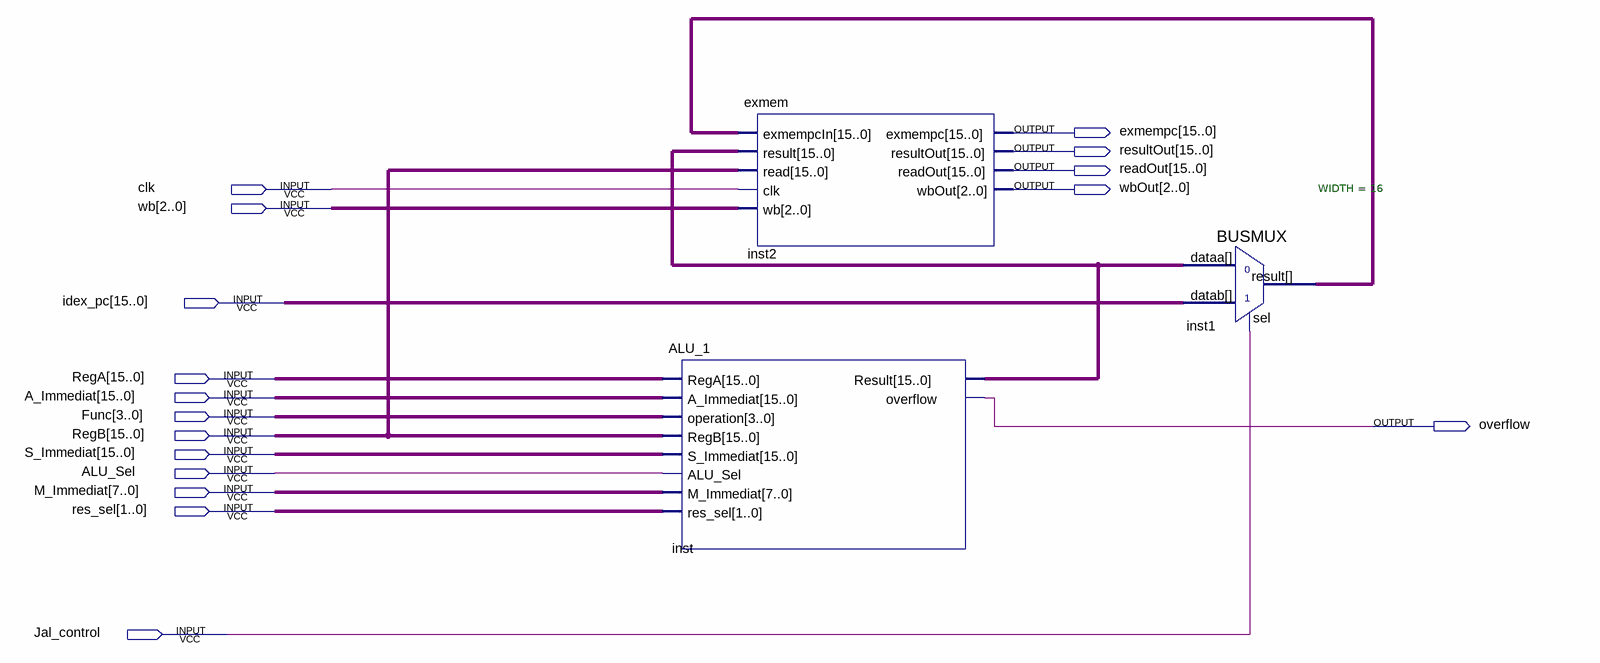
[diagram p0: schematic sheet]
// Quartus schematic stage3.bdf as structural Verilog: 3 symbols, 17 pins
module stage3 (
  input  clk,
  input  [2:0] wb,
  input  [15:0] idex_pc,
  input  [15:0] RegA,
  input  [15:0] A_Immediat,
  input  [3:0] Func,
  input  [15:0] RegB,
  input  [15:0] S_Immediat,
  input  ALU_Sel,
  input  [7:0] M_Immediat,
  input  [1:0] res_sel,
  input  Jal_control,
  output [15:0] exmempc,
  output [15:0] resultOut,
  output [15:0] readOut,
  output [2:0] wbOut,
  output overflow
);

  wire [15:0] inst1_result, inst_result;

  ALU_1 inst (
    .RegA(RegA), .A_Immediat(A_Immediat), .operation(Func), .RegB(RegB), .S_Immediat(S_Immediat),
    .ALU_Sel(ALU_Sel), .M_Immediat(M_Immediat), .res_sel(res_sel), .Result(inst_result), .overflow(overflow));
  exmem inst2 (
    .exmempcIn(inst1_result), .result(inst_result), .read(RegB), .clk(clk), .wb(wb), .exmempc(exmempc),
    .resultOut(resultOut), .readOut(readOut), .wbOut(wbOut));
  BUSMUX #(.WIDTH(16)) inst1 (.datab(idex_pc), .sel(Jal_control), .dataa(inst_result), .result(inst1_result));
endmodule
